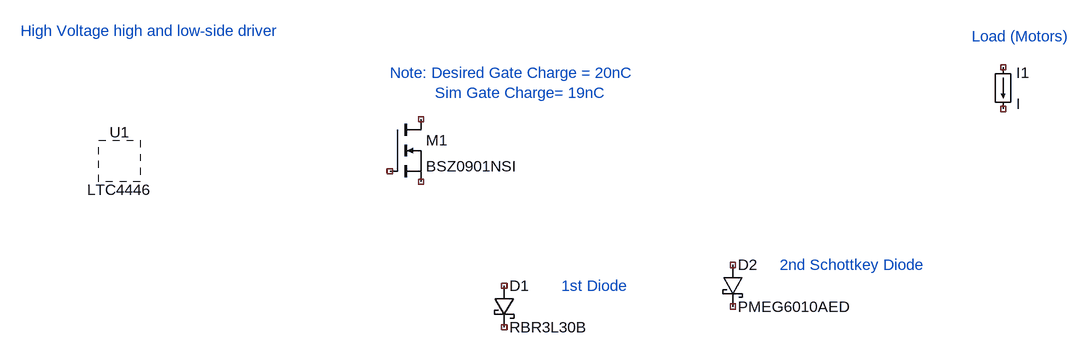
[diagram p0: schematic Rough_ESC_Schematic.asc]
Rough_ESC_Schematic.asc, the LTspice schematic file:
Version 4
SHEET 1 1224 680
SYMBOL nmos 160 112 R0
SYMATTR InstName M1
SYMATTR Value BSZ0901NSI
SYMBOL schottky 320 368 R0
SYMATTR InstName D1
SYMATTR Value RBR3L30B
SYMATTR Description Diode
SYMATTR Type diode
SYMBOL schottky 672 336 R0
SYMATTR InstName D2
SYMATTR Value PMEG6010AED
SYMATTR Description Diode
SYMATTR Type diode
SYMBOL PowerProducts\\LTC4446 -256 176 R0
SYMATTR InstName U1
SYMBOL load 1088 32 R0
SYMATTR InstName I1
TEXT 160 40 Left 2 ;Note: Desired Gate Charge = 20nC\n          Sim Gate Charge= 19nC
TEXT 424 368 Left 2 ;1st Diode
TEXT 760 336 Left 2 ;2nd Schottkey Diode
TEXT -408 -24 Left 2 ;High Voltage high and low-side driver
TEXT 1056 -16 Left 2 ;Load (Motors)

The netlist it stands for:
* Rough_ESC_Schematic.asc
M1 NC_01 NC_02 NC_03 NC_03 BSZ0901NSI
D1 NC_04 NC_05 RBR3L30B
D2 NC_06 NC_07 PMEG6010AED
* U1: LTC4446 (symbol PowerProducts\LTC4446 not available, pin order unknown); nets seen at it: 
I1 NC_08 NC_09 I
.model D D
.lib standard.dio
.model NMOS NMOS
.model PMOS PMOS
.lib standard.mos
* Note: Desired Gate Charge = 20nC
*           Sim Gate Charge= 19nC
* 1st Diode
* 2nd Schottkey Diode
* High Voltage high and low-side driver
* Load (Motors)
.backanno
.end